# Altium schematic sheet Documentation.SchDoc
size A4; SheetNumber: 1; SheetTotal: 7
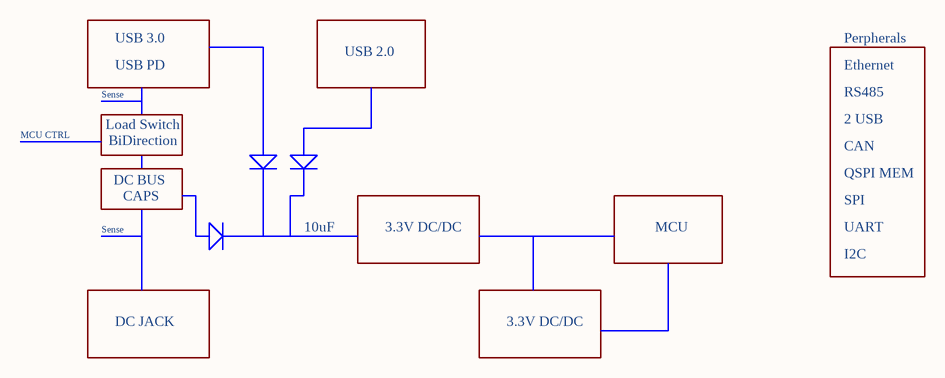
[diagram p0: Documentation.SchDoc]

## Notes on the sheet
- USB 3.0
- Perpherals
- Sense
- USB PD
- USB 2.0
- Ethernet
- RS485
- MCU CTRL
- Load Switch
- BiDirection
- DC BUS
- 2 USB
- QSPI MEM
- CAN
- CAPS
- 10uF
- 3.3V DC/DC
- MCU
- SPI
- UART
- I2C
- DC JACK